# EAGLE design adapter - 1640 (EAGLE 7.5.0)

## Sheet 1 of 3
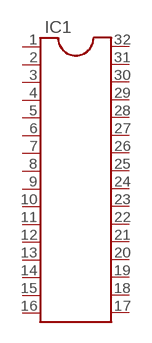
[diagram p0: schematic, sheet 1]

### Parts
IC1  DIL32  [DIL32]
Unconnected: IC1.1 IC1.2 IC1.3 IC1.4 IC1.5 IC1.6 IC1.7 IC1.8 IC1.9 IC1.10 IC1.11 IC1.12 IC1.13 IC1.14 IC1.15 IC1.16 IC1.17 IC1.18 IC1.19 IC1.20 IC1.21 IC1.22 IC1.23 IC1.24 IC1.25 IC1.26 IC1.27 IC1.28 IC1.29 IC1.30 IC1.31 IC1.32

## Sheet 2 of 3
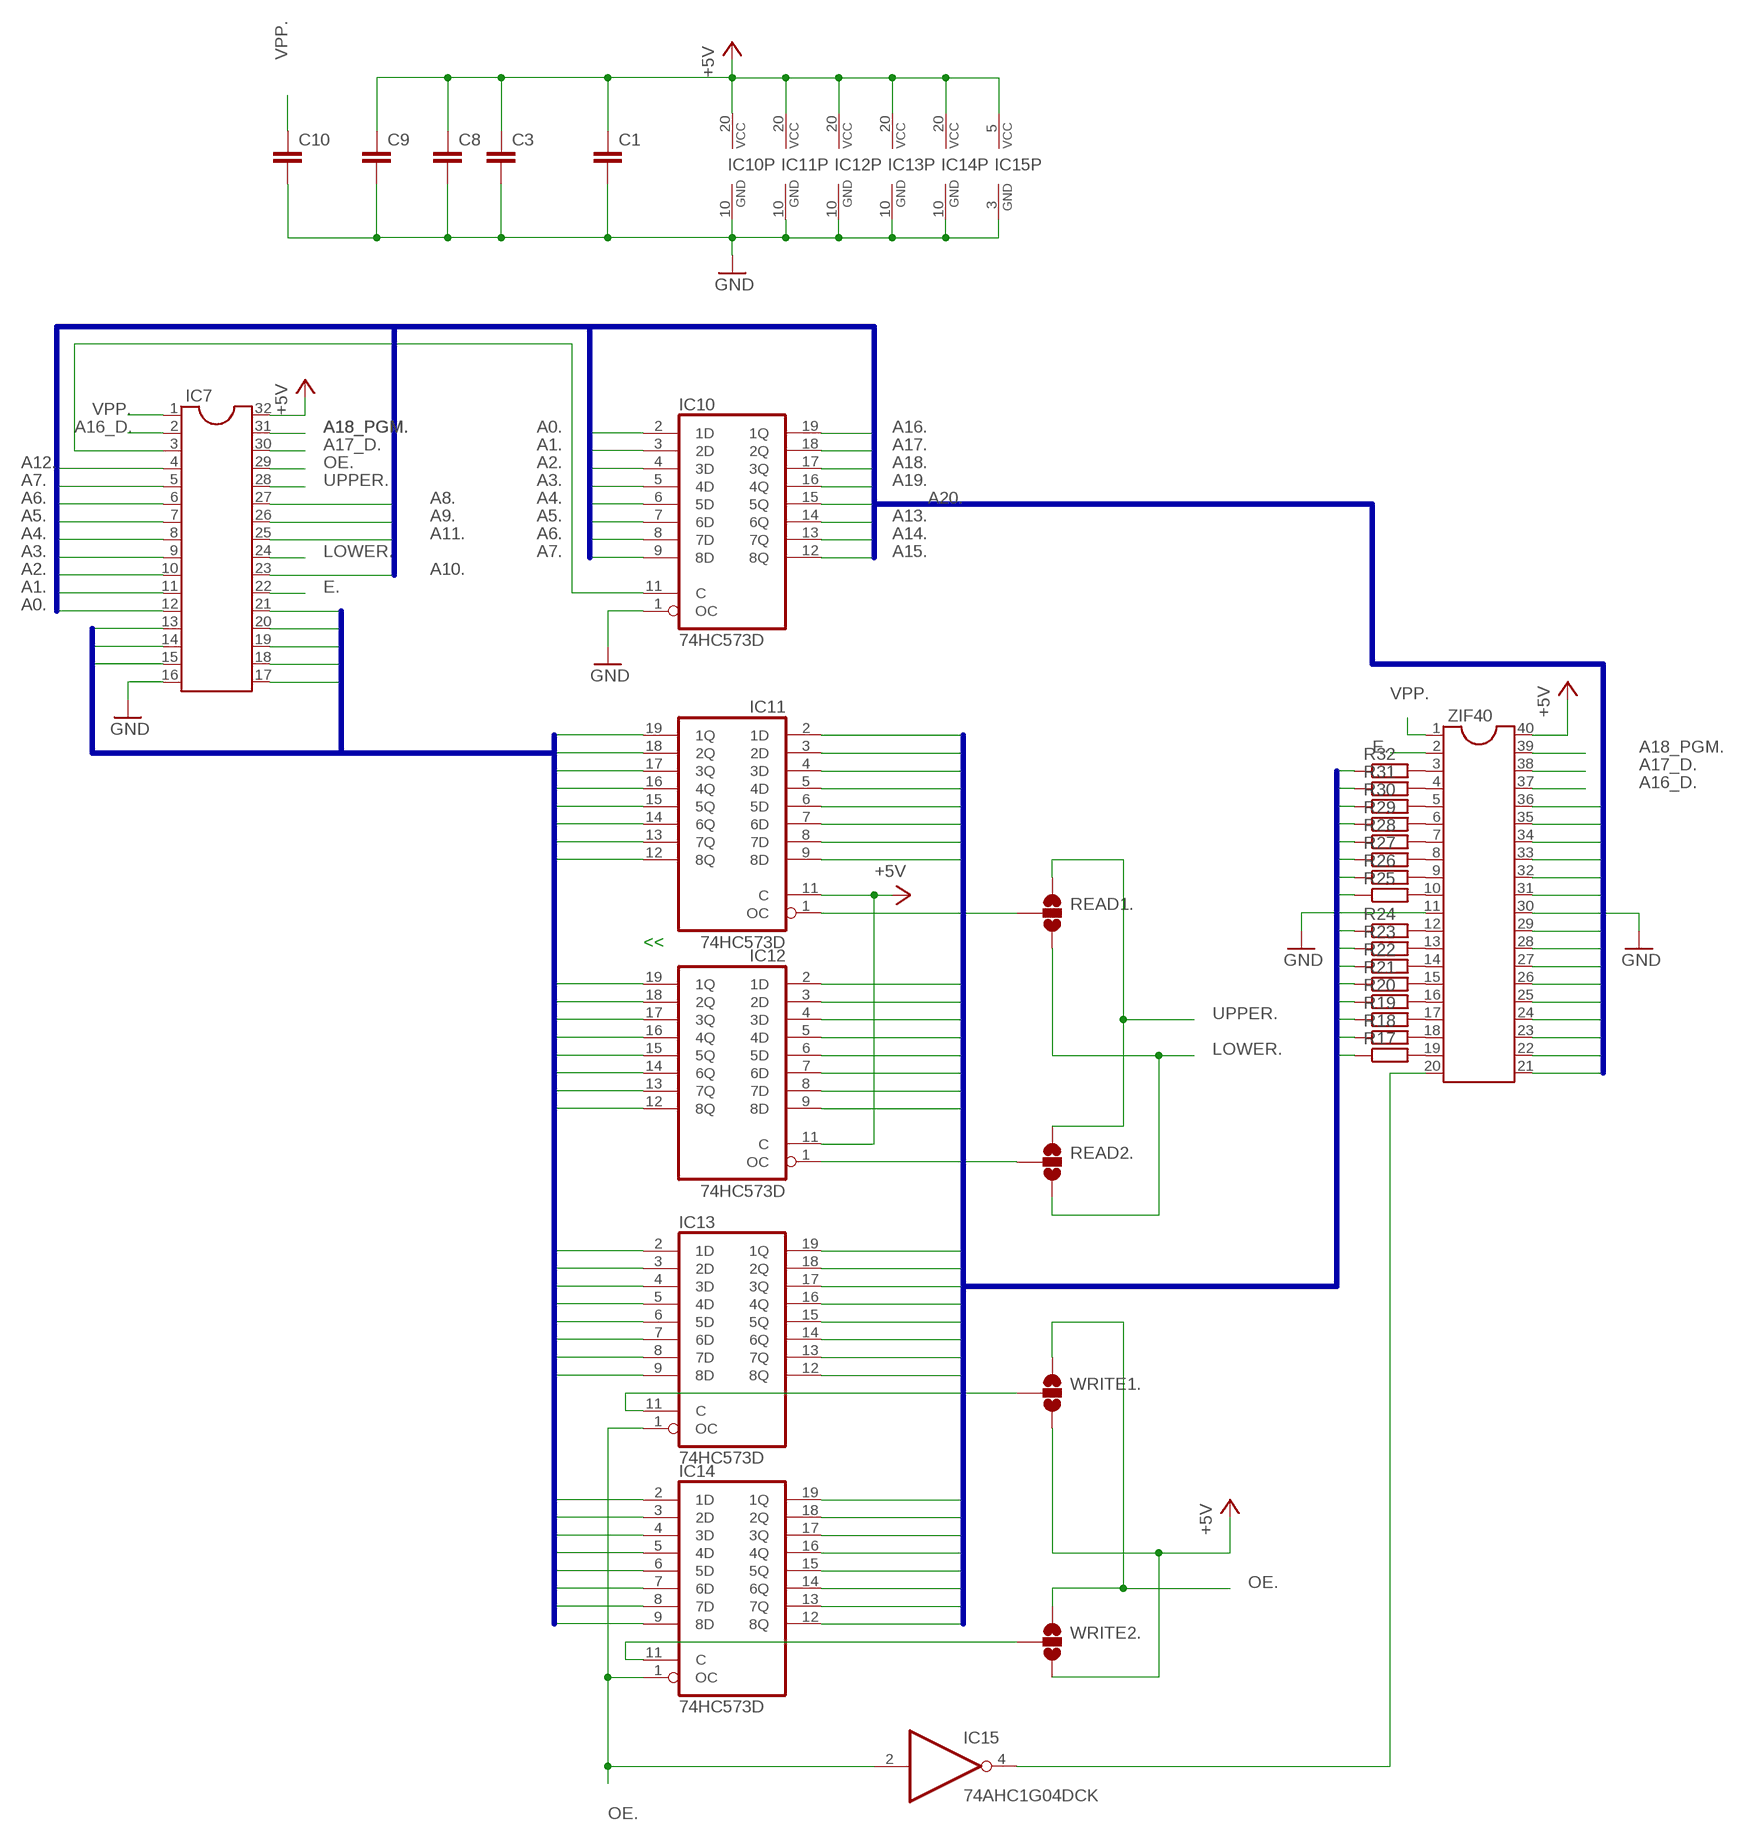
[diagram p1: schematic, sheet 2]

### Parts
C1  C-EUC1206  [C1206]
C3  C-EUC1206  [C1206]
C8  C-EUC1206  [C1206]
C9  C-EUC1206  [C1206]
C10  C-EUC1206  [C1206]
IC7  DIL32  [DIL32]
IC10  74HC573D  [SO20W]
IC11  74HC573D  [SO20W]
IC12  74HC573D  [SO20W]
IC13  74HC573D  [SO20W]
IC14  74HC573D  [SO20W]
IC15  74AHC1G04DCK  [SC70-5]
R17  R-EU_R0805  [R0805]
R18  R-EU_R0805  [R0805]
R19  R-EU_R0805  [R0805]
R20  R-EU_R0805  [R0805]
R21  R-EU_R0805  [R0805]
R22  R-EU_R0805  [R0805]
R23  R-EU_R0805  [R0805]
R24  R-EU_R0805  [R0805]
R25  R-EU_R0805  [R0805]
R26  R-EU_R0805  [R0805]
R27  R-EU_R0805  [R0805]
R28  R-EU_R0805  [R0805]
R29  R-EU_R0805  [R0805]
R30  R-EU_R0805  [R0805]
R31  R-EU_R0805  [R0805]
R32  R-EU_R0805  [R0805]
READ1.  JUMPER-PAD-3-NOYES_SILK  [PAD-JUMPER-3-NO_YES_SILK]
READ2.  JUMPER-PAD-3-NOYES_SILK  [PAD-JUMPER-3-NO_YES_SILK]
WRITE1.  JUMPER-PAD-3-NOYES_SILK  [PAD-JUMPER-3-NO_YES_SILK]
WRITE2.  JUMPER-PAD-3-NOYES_SILK  [PAD-JUMPER-3-NO_YES_SILK]
ZIF40  DIL40  [DIL40]

### Nets
+5V. [power]: C1.1 C3.1 C8.1 C9.1 IC7.32 IC10.20(VCC) IC11.11(C) IC11.20(VCC) IC12.11(C) IC12.20(VCC) IC13.20(VCC) IC14.20(VCC) IC15.5(VCC) WRITE1..3 WRITE2..3 ZIF40.40 ; supply symbol labelled +5V
A0.: IC7.12 IC10.2(1D)
A1.: IC7.11 IC10.3(2D) ZIF40.21
A2.: IC7.10 IC10.4(3D) ZIF40.22
A3.: IC7.9 IC10.5(4D) ZIF40.23
A4.: IC7.8 IC10.6(5D) ZIF40.24
A5.: IC7.7 IC10.7(6D) ZIF40.25
A6.: IC7.6 IC10.8(7D) ZIF40.26
A7.: IC7.5 IC10.9(8D) ZIF40.27
A8.: IC7.27 ZIF40.28
A9.: IC7.26 ZIF40.29
A10.: IC7.23 ZIF40.31
A11.: IC7.25 ZIF40.32
A12.: IC7.4 ZIF40.33
A13.: IC10.14(6Q) ZIF40.34
A14.: IC10.13(7Q) ZIF40.35
A15.: IC10.12(8Q) ZIF40.36
A16.: IC10.19(1Q)
A16_D.: IC7.2 ZIF40.37
A17.: IC10.18(2Q)
A17_D.: IC7.30 ZIF40.38
A18.: IC10.17(3Q)
A18_PGM.: IC7.31 ZIF40.39
A19.: IC10.16(4Q)
A20.: IC10.15(5Q)
D0.: IC7.13 IC11.19(1Q) IC12.19(1Q) IC13.2(1D) IC14.2(1D)
D1.: IC7.14 IC11.18(2Q) IC12.18(2Q) IC13.3(2D) IC14.3(2D)
D2.: IC7.15 IC11.17(3Q) IC12.17(3Q) IC13.4(3D) IC14.4(3D)
D3.: IC7.17 IC11.16(4Q) IC12.16(4Q) IC13.5(4D) IC14.5(4D)
D4.: IC7.18 IC11.15(5Q) IC12.15(5Q) IC13.6(5D) IC14.6(5D)
D5.: IC7.19 IC11.14(6Q) IC12.14(6Q) IC13.7(6D) IC14.7(6D)
D6.: IC7.20 IC11.13(7Q) IC12.13(7Q) IC13.8(7D) IC14.8(7D)
D7.: IC7.21 IC11.12(8Q) IC12.12(8Q) IC13.9(8D) IC14.9(8D)
E.: IC7.22 ZIF40.2
GND. [power]: C1.2 C3.2 C8.2 C9.2 C10.2 IC7.16 IC10.1(OC) IC10.10(GND) IC11.10(GND) IC12.10(GND) IC13.10(GND) IC14.10(GND) IC15.3(GND) ZIF40.11 ZIF40.30 ; supply symbol labelled GND
LOWER.: IC7.24 READ1..3 READ2..3
N$7: IC7.3 IC10.11(C)
N$8: IC11.1(OC) READ1..2
N$9: IC12.1(OC) READ2..2
N$10: IC13.11(C) WRITE1..2
N$11: IC14.11(C) WRITE2..2
N$12: IC15.4(O) ZIF40.20
N$29: R31.2 ZIF40.4
N$30: R32.2 ZIF40.3
N$31: R30.2 ZIF40.5
N$32: R29.2 ZIF40.6
N$33: R28.2 ZIF40.7
N$34: R27.2 ZIF40.8
N$35: R26.2 ZIF40.9
N$36: R25.2 ZIF40.10
N$37: R24.2 ZIF40.12
N$38: R23.2 ZIF40.13
N$39: R22.2 ZIF40.14
N$40: R21.2 ZIF40.15
N$41: R20.2 ZIF40.16
N$42: R19.2 ZIF40.17
N$43: R18.2 ZIF40.18
N$44: R17.2 ZIF40.19
OE.: IC7.29 IC13.1(OC) IC14.1(OC) IC15.2(I) WRITE1..1 WRITE2..1
Q0.: IC11.2(1D) IC13.19(1Q) R17.1
Q1.: IC11.3(2D) IC13.18(2Q) R18.1
Q2.: IC11.4(3D) IC13.17(3Q) R19.1
Q3.: IC11.5(4D) IC13.16(4Q) R20.1
Q4.: IC11.6(5D) IC13.15(5Q) R21.1
Q5.: IC11.7(6D) IC13.14(6Q) R22.1
Q6.: IC11.8(7D) IC13.13(7Q) R23.1
Q7.: IC11.9(8D) IC13.12(8Q) R24.1
Q8.: IC12.2(1D) IC14.19(1Q) R25.1
Q9.: IC12.3(2D) IC14.18(2Q) R26.1
Q10.: IC12.4(3D) IC14.17(3Q) R27.1
Q11.: IC12.5(4D) IC14.16(4Q) R28.1
Q12.: IC12.6(5D) IC14.15(5Q) R29.1
Q13.: IC12.7(6D) IC14.14(6Q) R30.1
Q14.: IC12.8(7D) IC14.13(7Q) R31.1
Q15.: IC12.9(8D) IC14.12(8Q) R32.1
UPPER.: IC7.28 READ1..1 READ2..1
VPP. [power]: C10.1 IC7.1 ZIF40.1

### Buses
A0.,A1.,A2.,A3.,A4.,A5.,A6.,A7.,A8.,A9.,A10.,A11.,A12.,A13.,A14.,A15.,A16.,A17.,A18.,A19.,A20.
D0,D1,D2,D3,D4,D5,D6,D7
Q0.,Q1.,Q2.,Q3.,Q4.,Q5.,Q6.,Q7.,Q8.,Q9.,Q10.,Q11.,Q12.,Q13.,Q14.,Q15.

### Notes on the sheet
- <<

## Sheet 3 of 3
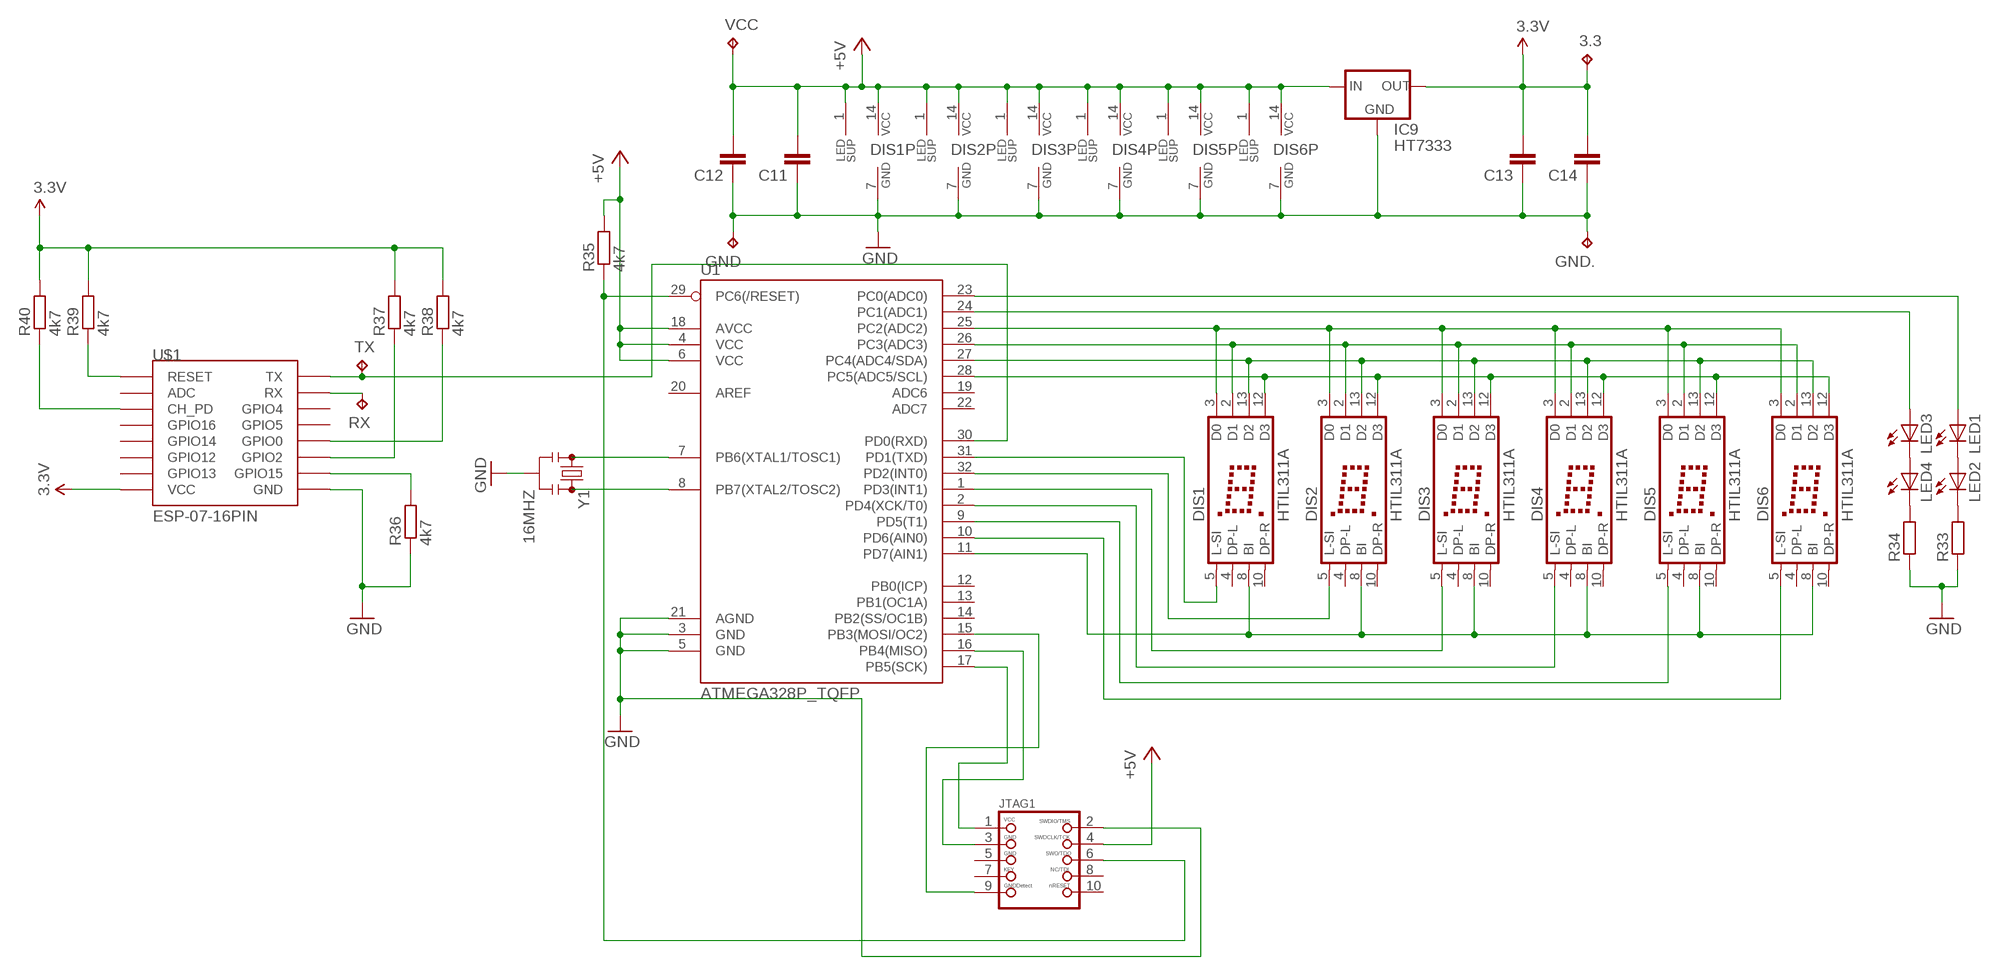
[diagram p2: schematic, sheet 3]

### Parts
3.3  TPTP15SQ  [TP15SQ]
C11  C-EUC1206  [C1206]
C12  C-EUC1206  [C1206]
C13  C-EUC1206  [C1206]
C14  C-EUC1206  [C1206]
DIS1  HTIL311A  [HTIL311A]
DIS2  HTIL311A  [HTIL311A]
DIS3  HTIL311A  [HTIL311A]
DIS4  HTIL311A  [HTIL311A]
DIS5  HTIL311A  [HTIL311A]
DIS6  HTIL311A  [HTIL311A]
GND  TPTP15SQ  [TP15SQ]
GND.  TPTP15SQ  [TP15SQ]
IC9  HT7333  [SOT-89]
JTAG1  JTAG-CORTEXM3  [2X05_1.27MM_SMT]
LED1  LED-0603  [LED-603]
LED2  LED-0603  [LED-603]
LED3  LED-0603  [LED-603]
LED4  LED-0603  [LED-603]
R33  R-EU_M1206  [M1206]
R34  R-EU_M1206  [M1206]
R35  4k7  R-EU_M1206  [M1206]
R36  4k7  R-EU_M1206  [M1206]
R37  4k7  R-EU_M1206  [M1206]
R38  4k7  R-EU_M1206  [M1206]
R39  4k7  R-EU_M1206  [M1206]
R40  4k7  R-EU_M1206  [M1206]
RX  TPTP15SQ  [TP15SQ]
TX  TPTP15SQ  [TP15SQ]
U1  ATMEGA328P_TQFP  [TQFP32-08]
U$1  ESP-07-16PIN  [ESP-07-16PIN]
VCC  TPTP15SQ  [TP15SQ]
Y1  16MHZ  RESONATOR16MHZ  [RESONATOR-SMD]

### Nets
3.3V: 3.3.TP C13.2 C14.2 IC9.1(OUT) R37.2 R38.2 R39.2 R40.2 U$1.VCC
+5V.2 [power]: C11.2 C12.2 DIS1.1(LEDSUP) DIS1.14(VCC) DIS2.1(LEDSUP) DIS2.14(VCC) DIS3.1(LEDSUP) DIS3.14(VCC) DIS4.1(LEDSUP) DIS4.14(VCC) DIS5.1(LEDSUP) DIS5.14(VCC) DIS6.1(LEDSUP) DIS6.14(VCC) IC9.3(IN) IC9.4(IN) JTAG1.4 R35.2 U1.4(VCC) U1.6(VCC) U1.18(AVCC) VCC.TP ; supply symbol labelled +5V
GND.2 [power]: C11.1 C12.1 C13.1 C14.1 DIS1.7(GND) DIS2.7(GND) DIS3.7(GND) DIS4.7(GND) DIS5.7(GND) DIS6.7(GND) GND..TP GND.TP IC9.2(GND) JTAG1.2 R33.1 R34.1 R36.1 U1.3(GND) U1.5(GND) U1.21(AGND) U$1.GND Y1.2 ; supply symbol labelled GND
N$45: DIS1.3(D0) DIS2.3(D0) DIS3.3(D0) DIS4.3(D0) DIS5.3(D0) DIS6.3(D0) U1.25(PC2(ADC2))
N$46: DIS1.2(D1) DIS2.2(D1) DIS3.2(D1) DIS4.2(D1) DIS5.2(D1) DIS6.2(D1) U1.26(PC3(ADC3))
N$47: DIS1.13(D2) DIS2.13(D2) DIS3.13(D2) DIS4.13(D2) DIS5.13(D2) DIS6.13(D2) U1.27(PC4(ADC4/SDA))
N$48: DIS1.12(D3) DIS2.12(D3) DIS3.12(D3) DIS4.12(D3) DIS5.12(D3) DIS6.12(D3) U1.28(PC5(ADC5/SCL))
N$49: DIS1.8(BI) DIS2.8(BI) DIS3.8(BI) DIS4.8(BI) DIS5.8(BI) DIS6.8(BI) U1.11(PD7(AIN1))
N$50: LED1.C LED2.A
N$51: LED3.C LED4.A
N$52: LED4.C R34.2
N$53: LED2.C R33.2
N$54: LED3.A U1.24(PC1(ADC1))
N$55: LED1.A U1.23(PC0(ADC0))
N$56: DIS1.5(L-SI) U1.31(PD1(TXD))
N$57: DIS2.5(L-SI) U1.32(PD2(INT0))
N$58: DIS3.5(L-SI) U1.1(PD3(INT1))
N$59: DIS4.5(L-SI) U1.2(PD4(XCK/T0))
N$60: DIS5.5(L-SI) U1.9(PD5(T1))
N$61: DIS6.5(L-SI) U1.10(PD6(AIN0))
N$62: JTAG1.1 U1.17(PB5(SCK))
N$63: JTAG1.6 R35.1 U1.29(PC6(/RESET))
N$64: JTAG1.3 U1.16(PB4(MISO))
N$65: JTAG1.9 U1.15(PB3(MOSI/OC2))
N$66: U1.7(PB6(XTAL1/TOSC1)) Y1.1
N$67: U1.8(PB7(XTAL2/TOSC2)) Y1.3
N$68: R39.1 U$1.REST(RESET)
N$69: R40.1 U$1.CH_PD
N$70: RX.TP U$1.RX
N$71: TX.TP U1.30(PD0(RXD)) U$1.TX
N$72: R36.2 U$1.GPIO15
N$73: R37.1 U$1.GPIO2
N$74: R38.1 U$1.GPIO0
Unconnected: DIS1.4(DP-L) DIS1.10(DP-R) DIS2.4(DP-L) DIS2.10(DP-R) DIS3.4(DP-L) DIS3.10(DP-R) DIS4.4(DP-L) DIS4.10(DP-R) DIS5.4(DP-L) DIS5.10(DP-R) DIS6.4(DP-L) DIS6.10(DP-R) JTAG1.5 JTAG1.7 JTAG1.8 JTAG1.10 U1.12(PB0(ICP)) U1.13(PB1(OC1A)) U1.14(PB2(SS/OC1B)) U1.19(ADC6) U1.20(AREF) U1.22(ADC7) U$1.ADC U$1.GPIO4 U$1.GPIO5 U$1.GPIO12 U$1.GPIO13 U$1.GPIO14 U$1.GPIO16

## Library data of the parts
3.3 GND GND. RX TX VCC = testpad:TP: Test pad
C1 C3 C8-C14 = rcl:C-EU: CAPACITOR, European symbol
DIS1-DIS6 = display-hp:HTIL311A: LED DISPLAY 1-character dot matrix, 2 decimal points Internal TTL MSI IC with Latch, Decoder, and Driver Source: http://www.taosinc.com .. til311-e6.pdf; OC_FARNELL: unknown; OC_NEWARK: unknown
IC1 IC7 = ic-package:DIL32: Dual In Line
IC9 = holtek2:HT73*
IC10-IC14 = 74xx-eu:74*573: 8-bit D latch BUS DRIVER
IC15 = 74xx-little-us:74*1G04: INVERTER Gate
JTAG1 = microbuilder:JTAG-CORTEXM3: Serial Wire (SW-DP) Connector This standard 0.05" 10-pin connector is for use with the Cortex M0/M3's native SWD (serial wire debugger) interface (SW-DP). Some boards support a 20-pin combined JTAG+SWD connector (SWJ-DP), such as the LPC1700 family, but many smaller devices only work with SWD which typically use the smaller 10-pin SW-DP connecter (the LPC1300 family, for example, only supports SWD). 2x05 1.27mm/0.05" Connector: This is the standard SMT connector defined by ARM for all Cortex devices, and should be used in most situations and for forward-compatibility since any new devices coming to market will likely use this connector. MOLEX 10 Pin 0.1" Connector: This 0.1" 10 pin connector has the same pin layout as the standard 0.05" connector, but is easier to work with if you are using standard jumper wires or custom cables to connect your SWD hardware. MOLEX 20 Pin 0.1" Connector: This 0.1" 20 pin connector is the same model used for ARM7/ARM9 JTAG debuggers, but is connected to match the pins on the Segger J-Link for ARM (which supports both JTAG and SWD debugging). See the following document from ARM for more information on Cortex M3 Debug Connectors: http://infocenter.arm.com/help/topic/com.arm.doc.faqs/attached/13634/cortex_debug_connectors.pdf And the following page for an overview with images of the different connector types: http://www.keil.com/peripherals/coresight/connectors.asp
LED1-LED4 = dp_devices:LED: Light Emitting Diode
R17-R40 = rcl:R-EU_: RESISTOR, European symbol
READ1. READ2. WRITE1. WRITE2. = SparkFun-Passives:JUMPER-PAD-3-NO
U1 = SparkFun-DigitalIC:ATMEGA328P_TQFP; PROD_ID: IC-09069
U$1 = esp8266modules:ESP-07-16PIN: ESP8266 Wifi Module ESP-07 - 16 pins; DIMENSIONS: 22.0 x 16.0 mm; PINS: 16; PITCH: 0.078" / 2 mm
Y1 = SparkFun-FreqCtrl:RESONATOR: Resonator Small SMD resonator. Used, eg, on the Arduino Pro/ Pro Mini boards. 8MHz- XTAL-08895 16MHz- XTAL-08900; PROD_ID: XTAL-08900
ZIF40 = ic-package:DIL40: Dual In Line

## Net classes
0 default: width 0.254 mm
1 power: width 0.508 mm

## Board
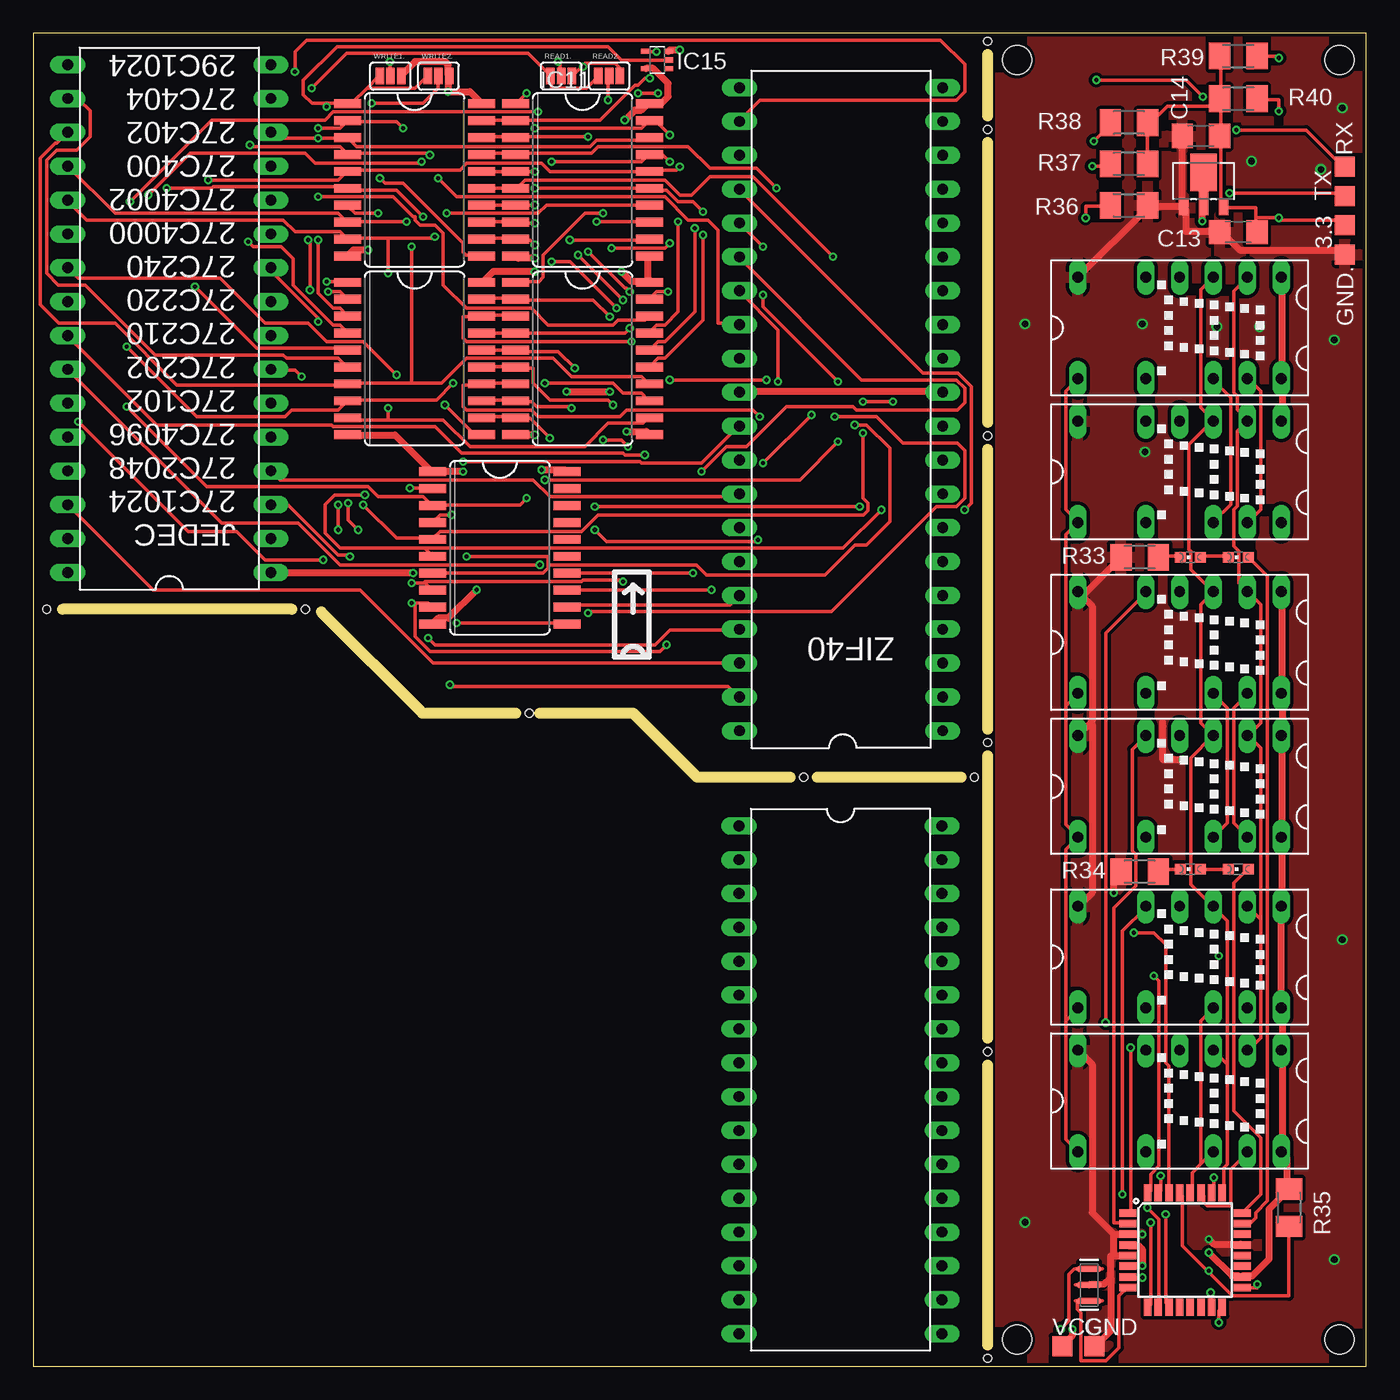
[diagram p3: board, top side]
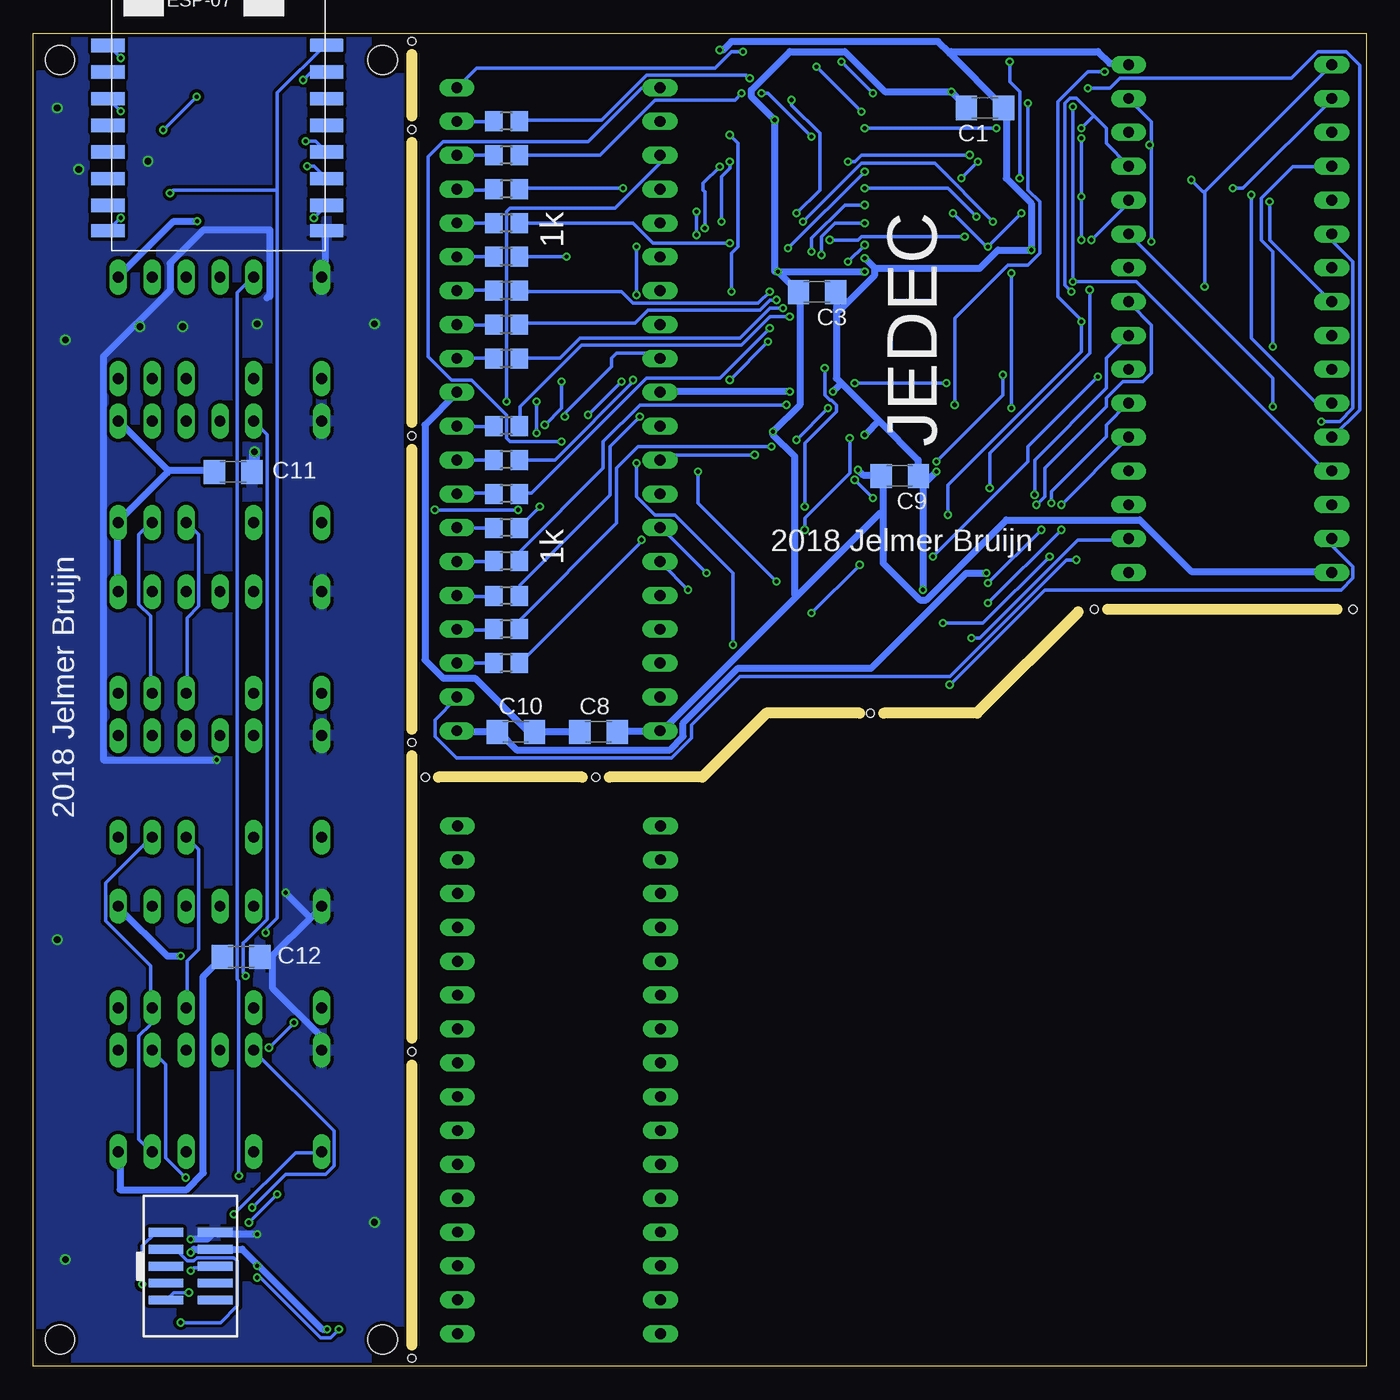
[diagram p4: board, bottom side, seen from below]

Size 100 x 100 mm. Coordinates in mm from the lower left corner, seen from the top.
Outline: 0,0 100,0 100,100 0,100 0,0
Copper layers (1*16): Top 0.035mm / dielectric 1.5mm / Bottom 0.035mm
Design rules "dirt_cheap_dirty_boards.v1": minimum track width 5mil, minimum drill 12mil, track to track 5mil, track to pad 5mil, pad to pad 5mil, via to via 5mil, smd to smd 0mil, copper to edge 10mil, drill to drill 10mil, minimum pad ring 10mil, minimum via ring 6mil, stop-mask expansion 2mil, vias tented up to drill 25mil, thermal gap 10mil
Holes 0.6 mm at 1,56.8 20.4,56.8 37.2,49 57.8,44.2 70.6,44.2 71.6,46.8 71.6,23.6 71.6,0.6 71.6,69.8 71.6,92.8 71.6,99.4
Holes 2.2 mm at 98,98 98,2 73.8,2 73.8,98
Milling: 12 lines

### Footprints (pad centres in the part's own frame; a part is rotated, then mirrored left to right if it is on the bottom)
TP15SQ = smd 1.5 x 1.5: TP 0,0
C1206 = smd 1.6 x 1.8: 1 -1.4,0; 2 1.4,0
HTIL311A = drill 0.813 long: 1 -3.81,7.62; 2 -3.81,5.08; 3 -3.81,2.54; 4 -3.81,0; 5 -3.81,-2.54; 7 -3.81,-7.62; 8 3.81,-7.62; 10 3.81,-2.54; 12 3.81,2.54; 13 3.81,5.08; 14 3.81,7.62
DIL32 = drill 0.813 long: 1 -19.05,-7.62; 2 -16.51,-7.62; 3 -13.97,-7.62; 4 -11.43,-7.62; 5 -8.89,-7.62; 6 -6.35,-7.62; 7 -3.81,-7.62; 8 -1.27,-7.62; 9 1.27,-7.62; 10 3.81,-7.62; 11 6.35,-7.62; 12 8.89,-7.62; 13 11.43,-7.62; 14 13.97,-7.62; 15 16.51,-7.62; 16 19.05,-7.62; 17 19.05,7.62; 18 16.51,7.62; 19 13.97,7.62; 20 11.43,7.62; 21 8.89,7.62; 22 6.35,7.62; 23 3.81,7.62; 24 1.27,7.62; 25 -1.27,7.62; 26 -3.81,7.62; 27 -6.35,7.62; 28 -8.89,7.62; 29 -11.43,7.62; 30 -13.97,7.62; 31 -16.51,7.62; 32 -19.05,7.62
SOT-89 = smd 0.7 x 1.1: 1 1.5,-2.385; 2 -1.5,-2.385 | smd 0.7 x 1.8: 3 0,-2.035 | smd 2 x 2.8: 4 0,0.265
SO20W = smd 0.66 x 2.032: 1 -5.715,-5.029; 2 -4.445,-5.029; 3 -3.175,-5.029; 4 -1.905,-5.029; 5 -0.635,-5.029; 6 0.635,-5.029; 7 1.905,-5.029; 8 3.175,-5.029; 9 4.445,-5.029; 10 5.715,-5.029; 11 5.715,5.029; 12 4.445,5.029; 13 3.175,5.029; 14 1.905,5.029; 15 0.635,5.029; 16 -0.635,5.029; 17 -1.905,5.029; 18 -3.175,5.029; 19 -4.445,5.029; 20 -5.715,5.029
SC70-5 = smd 0.4 x 0.7: 1 -0.65,-0.85; 2 0,-0.85; 3 0.65,-0.85; 4 0.65,0.85; 5 -0.65,0.85
2X05_1.27MM_SMT = smd 0.65 x 2.6: 1 -2.54,-1.85; 2 -2.54,1.85; 3 -1.27,-1.85; 4 -1.27,1.85; 5 0,-1.85; 6 0,1.85; 7 1.27,-1.85; 8 1.27,1.85; 9 2.54,-1.85; 10 2.54,1.85
LED-603 = smd 0.8 x 0.8: A 0,-0.75; C 0,0.75
R0805 = smd 1.3 x 1.5: 1 -0.95,0; 2 0.95,0
M1206 = smd 1.6 x 2: 1 -1.4,0; 2 1.4,0
PAD-JUMPER-3-NO_YES_SILK = smd 0.635 x 1.27: 1 -0.813,0; 2 0,0; 3 0.813,0
TQFP32-08 = smd 1.27 x 0.559: 1 -4.293,2.8; 2 -4.293,2; 3 -4.293,1.2; 4 -4.293,0.4; 5 -4.293,-0.4; 6 -4.293,-1.2; 7 -4.293,-2; 8 -4.293,-2.8; 17 4.293,-2.8; 18 4.293,-2; 19 4.293,-1.2; 20 4.293,-0.4; 21 4.293,0.4; 22 4.293,1.2; 23 4.293,2; 24 4.293,2.8 | smd 0.559 x 1.27: 9 -2.8,-4.293; 10 -2,-4.293; 11 -1.2,-4.293; 12 -0.4,-4.293; 13 0.4,-4.293; 14 1.2,-4.293; 15 2,-4.293; 16 2.8,-4.293; 25 2.8,4.293; 26 2,4.293; 27 1.2,4.293; 28 0.4,4.293; 29 -0.4,4.293; 30 -1.2,4.293; 31 -2,4.293; 32 -2.8,4.293
ESP-07-16PIN = smd 2.5 x 1: ADC -8.2,3.8; CH_PD -8.2,1.8; GND 8.2,-8.105; GPIO0 8.2,-2.2; GPIO2 8.2,-4.2; GPIO4 8.2,1.8; GPIO5 8.2,-0.2; GPIO12 -8.2,-4.2; GPIO13 -8.2,-6.2; GPIO14 -8.2,-2.2; GPIO15 8.2,-6.2; GPIO16 -8.2,-0.2; REST -8.2,5.8; RX 8.2,3.8; TX 8.2,5.8; VCC -8.2,-8.105
RESONATOR-SMD = smd 0.45 x 1.905: 1 -1.2,0; 2 0,0; 3 1.2,0
DIL40 = drill 0.813 long: 1 -24.13,-7.62; 2 -21.59,-7.62; 3 -19.05,-7.62; 4 -16.51,-7.62; 5 -13.97,-7.62; 6 -11.43,-7.62; 7 -8.89,-7.62; 8 -6.35,-7.62; 9 -3.81,-7.62; 10 -1.27,-7.62; 11 1.27,-7.62; 12 3.81,-7.62; 13 6.35,-7.62; 14 8.89,-7.62; 15 11.43,-7.62; 16 13.97,-7.62; 17 16.51,-7.62; 18 19.05,-7.62; 19 21.59,-7.62; 20 24.13,-7.62; 21 24.13,7.62; 22 21.59,7.62; 23 19.05,7.62; 24 16.51,7.62; 25 13.97,7.62; 26 11.43,7.62; 27 8.89,7.62; 28 6.35,7.62; 29 3.81,7.62; 30 1.27,7.62; 31 -1.27,7.62; 32 -3.81,7.62; 33 -6.35,7.62; 34 -8.89,7.62; 35 -11.43,7.62; 36 -13.97,7.62; 37 -16.51,7.62; 38 -19.05,7.62; 39 -21.59,7.62; 40 -24.13,7.62

### Placement (x,y rotation side)
3.3  98.4,85.6 0 top
C1  28.6,94.4 0 bottom
C3  41.2,80.6 0 bottom
C8  57.6,47.6 180 bottom
C9  35,66.8 0 bottom
C10  63.8,47.6 0 bottom
C11  85,67.1 180 bottom
C12  84.4,30.7 180 bottom
C13  90.4,85.1 0 top
C14  87.6,92.3 0 top
DIS1  86,77.9 270 top
DIS2  86,67.1 270 top
DIS3  86,54.3 270 top
DIS4  86,43.5 270 top
DIS5  86,30.7 270 top
DIS6  86,19.9 270 top
GND  79.6,1.5 0 top
GND.  98.4,83.4 0 top
IC1  60.56,21.49 270 top
IC7  10.2,78.6 90 top
IC9  87.8,89.3 0 top
IC10  35,61.4 270 top
IC11  41.2,89 270 top
IC12  41.2,75.6 270 top
IC13  28.6,89 270 top
IC14  28.6,75.6 270 top
IC15  46.8,98 90 top
JTAG1  88.2,7.5 270 bottom
LED1  90.4,60.7 90 top
LED2  86.8,60.7 90 top
LED3  90.4,37.3 90 top
LED4  86.8,37.3 90 top
R17  64.5,93.4 180 bottom
R18  64.5,90.85 180 bottom
R19  64.5,88.3 180 bottom
R20  64.5,85.75 180 bottom
R21  64.5,83.25 180 bottom
R22  64.5,80.7 180 bottom
R23  64.5,78.15 180 bottom
R24  64.5,75.6 180 bottom
R25  64.5,70.55 180 bottom
R26  64.5,68 180 bottom
R27  64.5,65.45 180 bottom
R28  64.5,62.9 180 bottom
R29  64.5,60.4 180 bottom
R30  64.5,57.8 180 bottom
R31  64.5,55.3 180 bottom
R32  64.5,52.75 180 bottom
R33  83,60.7 0 top
R34  83,37.1 0 top
R35  94.2,11.9 90 top
R36  82.2,87.1 180 top
R37  82.2,90.2 0 top
R38  82.2,93.3 0 top
R39  90.4,98.3 180 top
R40  90.4,95.1 180 top
READ1.  39.6,96.8 0 top
READ2.  43.2,96.8 0 top
RX  98.4,90 0 top
TX  98.4,87.8 0 top
U1  86.4,8.7 0 top
U$1  86.2,93.3 0 bottom
VCC  77.2,1.5 0 top
WRITE1.  26.8,96.8 0 top
WRITE2.  30.4,96.8 0 top
Y1  79.2,6.1 270 top
ZIF40  60.6,71.8 90 top

### Tracks (layer width: path | path; a pad name or v marks a point on that pad's centre or on a via)
3.3V  (via drill 0.3)
  Top 0.254: 91.7,86.15 91.7,85.15 C13.2 | 91.7,86.15 91.7,86.9 89.33,86.9 IC9.1 89.2,87.03 89.08,87.15 89.08,92.28 C14.2 89.08,92.4 89.08,95.03 R40.2 | 91.7,86.15 v93.45,86.15 93.5,86 98,86 3.3.TP | R37.2 83.58,90.15 83.58,93.03 R38.2 83.7,93.15 85.08,94.53 88.95,94.53 R40.2 | R39.2 89.08,98.28 89.08,95.15 R40.2
  Bottom 0.254: v93.45,86.15 94.33,85.28 U$1.VCC
+5V.  (via drill 0.3)
  Top 0.508: WRITE1..3 27.62,96.88 28.62,97.88 30.88,97.88 31.12,97.62 31.12,96.88 WRITE2..3 31.12,96.62 v31.12,95.62 32.75,95.62 33.62,94.75 IC13.20 | v44.12,82.12 44.88,81.38 46.12,81.38 IC12.20 46.12,81.62 46.12,83.25 IC11.11 | v44.5,70.12 46,70.12 46.12,70 IC12.11 | v37.62,82.12 34.5,82.12 33.75,81.38 IC14.20 | v44.38,93.5 45.12,94.25 45.62,94.25 46,94.62 IC11.20 46.38,94.75 47.12,94.75 47.62,95.25 47.62,96.25 46.5,97.38 46,97.38 IC15.5 | v38.12,67.25 39.88,67.25 40,67.12 IC10.20
  Bottom 0.508: C1.1 30,94.5 v31.12,95.62 36.12,95.62 39.12,98.62 43.25,98.62 46.12,95.75 46.12,95.25 v44.38,93.5 44.38,82.12 v44.12,82.12 | v44.12,82.12 C3.1 42.5,80.38 42.5,72.12 v44.5,70.12 44.5,69.88 42.88,68.25 42.88,57.88 42.75,57.75 | v44.12,82.12 v37.62,82.12 | C8.1 56.12,47.62 53,47.62 ZIF40.40 52.75,47.75 42.75,57.75 | v38.12,67.25 37.75,66.88 36.5,66.88 C9.1 36.25,66.62 36.25,64 | 36.25,64 36.25,60.25 33.5,57.5 33,57.5 27,63.5 17,63.5 13.12,59.62 2.62,59.62 IC7.32 | 42.75,57.75 36.5,64 36.25,64
+5V.2  (via drill 0.3)
  Top 0.508: IC9.4 87.83,89.53 87.83,87.28 IC9.3 87.83,87.03 87.7,86.9 v87.7,85.9 | DIS2.1 93.7,71.03 93.7,74.03 DIS1.14 93.7,74.28 93.7,81.65 DIS1.1 | U1.6 82.2,7.53 v83.2,7.53 83.2,8.78 82.95,9.03 82.2,9.03 U1.4 | v77.95,2.77 77.95,2.27 77.2,1.52 VCC.TP | v88.2,8.53 89.95,6.78 90.45,6.78 U1.18 90.7,6.78 91.45,6.78 92.7,8.03 92.7,11.78 94.2,13.28 R35.2 94.08,13.53 94.08,15.65 93.7,16.02 DIS6.14 93.7,16.27 93.7,23.52 DIS6.1 93.7,23.77 93.7,26.77 DIS5.14 93.58,27.15 93.58,34.27 DIS5.1 93.7,34.52 93.7,39.65 DIS4.14 93.7,39.9 93.7,47.15 DIS4.1 93.7,47.4 93.7,50.4 DIS3.14 93.7,50.65 93.7,58.02 DIS3.1
  Bottom 0.508: DIS3.1 93.7,58.15 93.7,63.15 DIS2.14 93.58,63.4 89.95,67.03 89.95,67.25 | v87.7,85.9 89.45,85.9 93.58,81.78 DIS1.1 | 89.95,67.25 89.95,67.28 93.58,70.9 DIS2.1 | v77.95,2.77 78.33,2.77 83.14,7.59 | 83.14,7.59 84.33,8.78 86.33,8.78 JTAG1.4 86.58,8.78 87.95,8.78 v88.2,8.53 | v83.2,7.53 83.14,7.59 | v88.95,30.77 89.95,30.77 93.58,34.4 DIS5.1 | C12.2 87.25,29.25 87.25,14.5 88.5,13.25 93.5,13.25 93.5,16 DIS6.14 | 89.95,67.25 86.5,67.25 C11.2
A0.  (via drill 0.3)
  Top 0.254: v28.25,65.88 29.88,65.88 IC10.2 | v20.75,80.75 20.75,84.5 v20.62,84.5
  Bottom 0.254: v28.25,65.88 28.25,68.5 20.75,76 v20.75,80.75 | v20.62,84.5 17.75,87.38 IC7.12
A1.  (via drill 0.3)
  Top 0.254: v7,72 13,66 25.12,66 25.88,65.25 29.25,65.25 29.88,64.62 IC10.3 30,64.62 36.5,64.62 v37,65.12 | v60.38,69.38 57.5,66.5 v38.38,66.5
  Bottom 0.254: v7,72 7,74.12 17.75,84.88 IC7.11 | v60.38,69.38 64.25,69.38 64.5,69.62 64.5,71.38 67.12,74 68.62,74 70.38,75.75 70.38,90.75 69.25,91.88 58.38,91.88 54.38,95.88 53,95.88 ZIF40.21 | v37,65.12 v38.38,66.5
A2.  (via drill 0.3)
  Top 0.254: v31.38,63.88 30.5,63.88 30,63.38 IC10.4 | v21.38,78.38 21.38,78.62 17.88,82.12 17.88,82.38 IC7.10 | v19.62,97.12 19.62,98.62 20.5,99.5 68.05,99.5 69.88,97.67 69.88,95.62 69.25,95 54.5,95 53,93.5 ZIF40.22
  Bottom 0.254: v31.38,63.88 31.38,66.12 21.38,76.12 v21.38,78.38 21.38,78.5 23.12,80.25 23.12,94.88 20.88,97.12 v19.62,97.12
A3.  (via drill 0.3)
  Top 0.254: v24.75,64.62 27.25,62.12 29.88,62.12 IC10.5 30,62.12 30.5,62.62 41.12,62.62 42.38,63.88 62.29,63.88 62.62,64.21 62.62,64.75 62.25,65.12 v62.25,70 | v62.25,72.38 v64.5,72.38
  Bottom 0.254: v24.75,64.62 24.12,65.25 24.12,67.38 19.5,72 19.5,72.62 18.25,73.88 16.75,73.88 16.12,74.5 16.12,78.12 17.75,79.75 IC7.9 | v64.5,72.38 64.5,86.62 64.25,86.88 56.38,86.88 53,90.25 53,90.75 ZIF40.23 | v62.25,70 v62.25,72.38
A4.  (via drill 0.3)
  Top 0.254: 29.44,61.31 29.38,61.38 23,61.38 21.88,62.5 21.88,64.63 22.62,65.38 v24.88,65.38 | 29.44,61.31 29.88,60.88 IC10.6 | v69.88,64.25 70.38,64.75 70.38,73.5 69.38,74.5 66.75,74.5 53,88.25 ZIF40.24 | v63.62,64.25 60.75,61.38 29.5,61.38 29.44,61.31
  Bottom 0.254: v24.88,65.38 24.88,68 19.5,73.38 19.5,75.62 17.88,77.25 IC7.8 | v63.62,64.25 v69.88,64.25
A5.  (via drill 0.3)
  Top 0.254: 38.62,60.12 38.62,60.75 v32.5,60.75 | 38.62,60.12 38.62,59.88 38.25,59.5 30,59.5 IC10.7 | v20.12,74.25 19.62,74.75 17.88,74.75 IC7.7 | v54.75,84 ZIF40.25 | v54.75,80.38 54.75,79.5 v60.38,73.88 | v61.62,70.62 62.5,70.62 64.25,68.88 64.25,63.38 62.49,61.62 61.62,61.62 59.38,59.38 50.5,59.38 49.75,60.12 38.62,60.12
  Bottom 0.254: v32.5,60.75 25.38,67.88 25.38,69 v20.12,74.25 | v54.75,80.38 v54.75,84 | v60.38,73.88 60.38,71.88 v61.62,70.62
A6.  (via drill 0.3)
  Top 0.254: 29.38,58.75 29.88,58.25 IC10.8 | v28.38,58.75 29.38,58.75 | v24.38,62.75 23.62,63.5 v23.62,64.75 | v50.12,67.12 52,69 53.5,69 56.5,72 61.5,72 61.75,71.75 69.31,71.75 69.88,72.31 69.88,73.38 69.25,74 62.12,74 53,83.12 ZIF40.26 | v44.25,58.88 44.12,59 41.25,59 41.12,58.88 29.38,58.88 29.38,58.75
  Bottom 0.254: v24.38,62.75 v28.38,58.75 | v23.62,64.75 23.62,65.62 19.5,69.75 19.5,70.62 17.88,72.25 IC7.6 | v50.12,67.12 50.12,64.75 v44.25,58.88
A7.  (via drill 0.3)
  Top 0.254: v22.88,64.62 v22.88,62.75 | IC10.9 29.88,57 29.62,57.25 v28.38,57.25 28.62,57.12 28.62,54.75 29.75,53.62 47,53.62 v47.5,54.12 | v55.88,73.88 55.88,77.75 53,80.62 ZIF40.27 | v54.75,67.75 v58.38,71.38
  Bottom 0.254: v22.88,62.75 v28.38,57.25 | v22.88,64.62 17.88,69.62 IC7.5 | v58.38,71.38 v55.88,73.88 | v54.75,67.75 54.75,65.25 53.38,63.88 51.88,63.88 47.5,59.5 v47.5,54.12
A8.  (via drill 0.3)
  Top 0.254: v8.62,87.88 11.75,91 20.38,91 21.12,90.25 29,90.25 v29.12,90.38 | v30.38,89.12 31.75,87.75 47.38,87.75 49.12,86 50.62,86 51.38,85.25 51.38,78.25 52.88,78.25 ZIF40.28
  Bottom 0.254: IC7.27 3.75,72.25 8.62,77.12 v8.62,87.88 | v30.38,89.12 v29.12,90.38
A9.  (via drill 0.3)
  Top 0.254: v38,60.12 23,60.12 19.88,63.25 14.12,63.25 2.62,74.75 IC7.26 | v41.62,56.5 41.75,56.62 59.88,56.62 67.75,64.5 69.25,64.5 69.88,65.12 69.88,68.7 69.33,69.25 65.25,69.25 63.25,71.25 v60.12,71.25
  Bottom 0.254: v41.62,56.5 v38,60.12 | v60.12,71.25 60.12,71.5 56.62,75 56.62,75.62 56.25,76 53.38,76 53,75.62 ZIF40.29
A10.  (via drill 0.3)
  Top 0.254: v27.25,74.38 24.75,76.88 22,76.88 20.62,78.25 17.38,78.25 14,81.62 3.38,81.62 2.62,82.38 IC7.23 | v32.25,67.88 45.5,67.88 45.62,67.75 50.12,67.75 52.88,70.5 ZIF40.31
  Bottom 0.254: v27.25,74.38 27.25,72.88 v32.25,67.88
A11.  (via drill 0.3)
  Top 0.254: v45.88,68.38 44.38,68.38 44.25,68.5 32.12,68.5 30.12,70.5 22.5,70.5 22.38,70.62 9.25,70.62 2.62,77.25 IC7.25
  Bottom 0.254: v45.88,68.38 52.5,68.38 52.88,68 ZIF40.32
A12.
  Top 0.254: IC7.4 17.88,67.12 18.5,66.5 37.5,66.5 38.75,65.25 52.75,65.25 52.88,65.38 ZIF40.33
A13.  (via drill 0.3)
  Top 0.254: v49.5,59.5 40.12,59.5 IC10.14
  Bottom 0.254: v49.5,59.5 52.88,62.88 ZIF40.34
A14.  (via drill 0.3)
  Top 0.254: v50.88,58.25 40.12,58.25 IC10.13
  Bottom 0.254: v50.88,58.25 52.88,60.25 ZIF40.35
A15.
  Top 0.254: IC10.12 40.12,57 40.25,57.12 52.25,57.12 52.88,57.75 ZIF40.36
A16_D.  (via drill 0.3)
  Top 0.254: v29.62,54.62 30.12,54.12 46.62,54.12 47.75,55.25 52.88,55.25 ZIF40.37
  Bottom 0.254: v29.62,54.62 29,54.62 21.62,62 17.88,62 IC7.2
A17_D.
  Top 0.254: ZIF40.38 30,52.75 24.5,58.25 9,58.25 2.62,64.62 IC7.30
A18_PGM.  (via drill 0.3)
  Top 0.254: v31.25,51.12 31.38,51 52.12,51 52.88,50.25 ZIF40.39
  Bottom 0.254: v31.25,51.12 24.12,58.25 1.88,58.25 1,59.12 1,60 2.5,61.5 2.5,62 IC7.31
D0.  (via drill 0.3)
  Top 0.254: v47.62,80.62 46.75,80.62 46.25,80.12 IC12.19 | v47.75,92.38 46.75,93.38 46.25,93.38 IC11.19 46.12,93.38 45.62,92.88 v37.62,92.88 | v22.12,80.62 23,80.62 23.5,80.12 IC14.2 | v21.38,92.88 23,92.88 23.5,93.38 IC13.2 23.62,93.38 27.25,93.38 v27.75,92.88
  Bottom 0.254: v47.62,80.62 47.62,83.5 47.12,84 47.12,91.75 v47.75,92.38 | v22.12,80.62 22.62,81.12 22.62,94.75 22.25,95.12 21.75,95.12 20.44,93.81 | 20.44,93.81 19.5,92.88 19.5,91.75 17.88,90.12 IC7.13 | 20.44,93.81 v21.38,92.88 | v27.75,92.88 v37.62,92.88
D1.  (via drill 0.3)
  Top 0.254: v21.38,84.5 21.38,80.5 22.5,79.38 23,79.38 23.5,78.88 IC14.3 | v21.38,87.75 27,87.75 28.5,86.25 28.62,86.25 28.62,86 29,85.62 30.12,85.62 30.75,85 30.75,81.12 32.5,79.38 37.38,79.38 38.62,78.12 43.5,78.12 43.88,78.5 45.88,78.5 46.12,78.75 IC12.18 | IC11.18 46.12,92.12 46,92 42.25,92 41.75,91.5 24.25,91.5 23.62,92.12 IC13.3 23.5,92.12 v21.38,92.12 18.25,92.12 17.88,92.5 IC7.14
  Bottom 0.254: v21.38,92.12 v21.38,87.75 v21.38,84.5
D2.  (via drill 0.3)
  Top 0.254: v48.38,85.88 48.38,79.12 47.38,78.12 46.75,78.12 46.25,77.62 IC12.17 | v47.75,90.38 47.25,90.88 46.25,90.88 IC11.17 46.12,90.88 45.62,90.38 v38.88,90.38 | v16.12,84.38 16.5,84 18.59,84 19.5,83.09 19.5,81.12 22.5,78.12 23,78.12 23.5,77.62 IC14.4 | v16.25,91.62 16.38,91.5 23,91.5 23.5,91 IC13.4 23.62,91 29.62,91 v29.75,90.88
  Bottom 0.254: v48.38,85.88 48.38,89.25 47.75,89.88 v47.75,90.38 | 16.12,91.62 16.12,93.38 17.75,95 IC7.15 | 16.12,91.62 v16.12,84.38 | v16.25,91.62 16.12,91.62 | v38.88,90.38 38.38,90.38 37.88,90.88 v29.75,90.88
D3.  (via drill 0.3)
  Top 0.254: v49.62,85.38 49.62,79.12 47.38,76.88 46.88,76.88 46.25,76.25 IC12.16 | v48.5,90 48.25,89.75 46.25,89.75 IC11.16 46.12,89.62 38.75,89.62 38.12,90.25 32.5,90.25 32,89.75 23.62,89.75 IC13.5 23.5,89.62 22.88,89 v13.12,89 | v12.12,81 16.75,76.38 23.38,76.38 23.5,76.25 IC14.5
  Bottom 0.254: v49.62,85.38 49.62,88.12 49.75,88.25 49.75,88.75 v48.5,90 | 12.12,88.12 v12.12,81 | 12.12,88.12 2.62,97.62 IC7.17 | v13.12,89 12.25,88.12 12.12,88.12
D4.  (via drill 0.3)
  Top 0.254: v50.25,84.88 50.25,78.5 47.38,75.62 46.88,75.62 46.25,75 IC12.15 | v50.25,86.62 49.5,87.38 48.38,87.38 47.5,88.25 46.25,88.25 IC11.15 46.12,88.38 v37.62,88.38 | IC14.6 23.5,75 22.88,75.62 19,75.62 18.75,75.88 9.12,75.88 3.88,81.12 1.88,81.12 1,82 1,90.5 1.75,91.25 3.25,91.25 4.25,92.25 4.25,94.17 3.42,95 2.62,95 IC7.18 | v10,88.38 13.38,88.38 13.5,88.5 23.38,88.5 23.5,88.38 IC13.6 23.62,88.25 27.25,88.25 v29.25,86.25
  Bottom 0.254: v50.25,86.62 v50.25,84.88 | v10,88.38 9.25,88.38 2.62,95 IC7.18 | v37.62,88.38 31.38,88.38 v29.25,86.25
D5.  (via drill 0.3)
  Top 0.254: 28.38,73.75 30.62,73.75 32.5,75.62 39,75.62 40.38,74.25 45.62,74.25 46.12,73.75 IC12.14 | 28.38,73.75 23.62,73.75 IC14.7 23.5,73.62 10.75,73.62 6.12,78.25 1.89,78.25 0.5,79.64 0.5,90.62 1.62,91.75 1.75,91.75 2.5,92.5 IC7.19 | v25.88,86.5 24.12,86.5 23.62,87 IC13.7 | 28.38,73.75 v28.38,84 | v31,86.5 37.88,86.5 38.5,87.12 46.12,87.12 IC11.14
  Bottom 0.254: v25.88,86.5 v28.38,84 28.5,84 v31,86.5
D6.  (via drill 0.3)
  Top 0.254: v7,76.5 12.25,71.25 18.88,71.25 19.38,71.75 22.88,71.75 23.5,72.38 IC14.8 23.62,72.5 30.25,72.5 v31.5,73.75 | IC7.20 2.62,90 6.12,86.5 22.88,86.5 23.5,85.88 IC13.8 23.62,85.88 v28,85.88 | v38.38,73.75 43.5,73.75 44.25,73 45.62,73 46.12,72.5 IC12.13 | v42.25,85.88 46.12,85.88 IC11.13
  Bottom 0.254: v7,76.5 7,83.62 7.88,84.5 7.88,87.62 5.5,90 2.62,90 IC7.20 | v31.5,73.75 v38.38,73.75 | v42.25,85.88 37.88,90.25 32.38,90.25 v28,85.88
D7.  (via drill 0.3)
  Top 0.254: 26.62,71 30.75,71 32.75,69 41.38,69 43.12,70.75 45.75,70.75 46.12,71.12 IC12.12 | 26.62,71 23.75,71 23.62,71.12 IC14.9 | IC7.21 2.62,87.38 4,86 18.75,86 19.62,85.12 23,85.12 23.5,84.62 IC13.9 23.62,84.62 26.62,84.62 | v40.25,84.5 46.12,84.5 IC11.12 | v30.12,84.75 30,84.62 26.62,84.62 | v26.62,71.88 26.62,71 | 26.62,84.62 v26.62,82
  Bottom 0.254: v40.25,84.5 38.12,84.5 37.88,84.75 v30.12,84.75 | v26.62,82 v26.62,71.88
E.  (via drill 0.3)
  Top 0.254: v3.38,70.88 11.62,62.62 15.25,62.62 17.38,60.5 v21.75,60.5
  Bottom 0.254: v3.38,70.88 2,70.88 1,71.88 1,82.88 2.5,84.38 2.5,84.88 IC7.22 | v21.75,60.5 22.5,60.5 31.25,51.75 47,51.75 50.62,48.12 50.62,47.12 52.12,45.62 68.25,45.62 69.88,47.25 69.88,48.5 68.25,50.12 ZIF40.2
GND.  (via drill 0.3)
  Top 0.508: v25.12,83.75 24,83.75 23.62,83.38 IC13.10 | ZIF40.30 53,73.12 68.12,73.12 ZIF40.11 | IC14.10 23.62,69.88 27.12,69.88 29.88,67.12 IC10.1 30.12,67.12 v32.25,67.12 | v33.25,58.25 31.12,56.12 30.38,56.12 30,55.75 IC10.10 | v37.62,69.88 36.25,69.88 IC12.10 | v37.62,83.12 36.38,83.12 36.25,83.25 IC11.10 | v40,73.12 v43.25,73.12 | v48.5,98.75 47.75,98.75 IC15.3
  Bottom 0.508: 31.25,98.5 27.25,94.5 C1.2 27,94.25 27,89.12 25.12,87.25 v25.12,83.75 27.62,83.75 29,82.38 36.88,82.38 | 31.25,98.5 32.12,99.38 47.62,99.38 48.25,98.75 v48.5,98.75 | IC7.16 17.88,97.75 19.25,97.75 20.12,98.62 31.12,98.62 31.25,98.5 | C8.2 59,47.62 62.38,47.62 C10.2 62.62,47.62 62.88,47.62 66.88,51.62 69.25,51.62 70.62,53 70.62,70.62 68.25,73 ZIF40.11 | 39.38,73.75 39.75,74.12 39.75,79.25 | 39.38,73.75 36.56,70.94 | 36.56,70.94 33.62,68 33.62,66.88 C9.2 | 39.75,79.25 39.75,80.5 C3.2 | v33.25,58.25 33.25,66.38 33.5,66.62 C9.2 | 36.56,70.94 v37.62,69.88 | 36.88,82.38 v37.62,83.12 | 36.88,82.38 36.88,81.88 39.5,79.25 39.75,79.25 | v32.25,67.12 33,66.38 C9.2 | v43.25,73.12 52.88,73.12 ZIF40.30 | 39.38,73.75 v40,73.12
GND.2  (via drill 0.3, 0.5)
  Top 0.508: v88.2,9.53 88.58,9.15 90.58,9.15 U1.21 | 81.08,8.28 80.83,8.28 80.83,6.65 | 81.08,8.28 82.08,8.28 U1.5 | 80.83,6.65 80.33,6.15 Y1.2 | 81.08,9.9 U1.3 v83.2,9.9 | 81.08,8.28 81.08,9.9 | 80.83,6.65 80.83,2.65 79.7,1.52 GND.TP | v81.08,35.52 81.08,36.52 81.58,37.02 R34.1 | 81.08,9.9 79.45,11.53 79.45,22.65 78.45,23.65 DIS6.7 | IC9.2 86.2,87.03 83.7,87.03 R36.1 83.45,86.9 83.45,86.78 78.45,81.78 DIS1.7 | C14.1 86.2,87.28 IC9.2 | IC9.2 86.45,86.78 86.45,85.15 88.95,85.15 C13.1 89.25,85 90.5,83.75 98,83.75 98.25,83.5 GND..TP | 79.33,48.27 79.45,48.4 79.45,57.02 78.45,58.02 DIS3.7 78.83,57.9 81.45,60.52 R33.1 | 79.33,48.27 78.45,47.4 DIS4.7 | DIS5.7 78.45,34.52 79.45,35.52 79.45,48.15 79.33,48.27 | v86.25,45.5 84.75,45.5 84.75,48 84.73,48.36
  Bottom 0.508: v88.2,9.53 86.95,9.53 86.45,10.03 JTAG1.2 86.2,9.9 v83.2,9.9 | 82.08,30.77 82.33,30.77 | 79.2,33.65 78.45,34.4 DIS5.7 | 79.2,33.65 82.08,30.77 | 79.2,33.65 v81.08,35.52 | 82.08,30.77 82.08,28.4 78.45,24.77 78.45,23.77 DIS6.7 | U$1.GND 78.08,85.15 78.08,82.03 78.33,81.78 DIS1.7 | v86.25,45.5 94.75,45.5 94.75,75.75 89.75,80.75 89.75,82.75 87.25,85.25 82.25,85.25 82.25,80.25 82.49,80.15
  Bottom 0.813: C11.1 83.4,67.1 v83.4,68.6
  other vias: 98.2,94.4 74.4,78.2 83.2,78.2 97.6,77 88.8,78 92,78 91.4,90.4 96.6,89.8 74.4,10.8 97.6,8 98.2,32
  pour Bottom (isolate 0.254): 72.8,99.6 99.6,99.6 99.6,0.4 72.6,0.4 72.6,99.6
  pour Top (isolate 0.254): 72.8,99.6 99.6,99.6 99.6,0.4 72.6,0.4 72.6,99.6
LOWER.  (via drill 0.3)
  Top 0.254: 41.19,97.56 41.38,97.75 43.62,97.75 44,97.38 44,96.88 READ2..3 | 41.19,97.56 40.5,96.88 READ1..3 | v37.88,94.12 22.5,94.12 21.88,93.5 13.38,93.5 v7.25,87.38 | v41.25,97.5 41.19,97.56
  Bottom 0.254: v37.88,94.12 v41.25,97.5 | v7.25,87.38 7.25,84.5 2.62,79.88 IC7.24
N$7  (via drill 0.3)
  Top 0.254: v31.75,55.75 40,55.75 IC10.11 | v23.75,60.75 23.62,60.88 22.88,60.88 19.12,64.62 17.88,64.62 IC7.3
  Bottom 0.254: v31.75,55.75 28.75,55.75 v23.75,60.75
N$8  (via drill 0.3)
  Top 0.254: v39.38,97.88 39.5,97.88 39.5,96.88 READ1..2 | v37,95.5 36.25,94.75 IC11.1
  Bottom 0.254: v37,95.5 v39.38,97.88
N$9  (via drill 0.3)
  Top 0.254: v43.12,95 43.12,96.75 READ2..2 | v42.75,86.5 41.38,86.5 38.25,83.38 38.25,81.7 37.92,81.38 36.25,81.38 IC12.1
  Bottom 0.254: v43.12,95 43.12,94.62 41,92.5 41,88.25 v42.75,86.5
N$10  (via drill 0.3)
  Top 0.254: v26.75,97.88 26.75,96.88 WRITE1..2 | v26,89.12 26.38,88.75 27.75,88.75 32.25,84.25 32.25,83.58 32.45,83.38 33.62,83.38 IC13.11
  Bottom 0.254: v26.75,97.88 26.75,96.38 26,95.62 v26,89.12
N$11  (via drill 0.3)
  Top 0.254: v25.38,94.75 29.23,94.75 30.38,95.89 30.38,96.75 WRITE2..2 | v30.88,72.12 33,70 33.62,70 IC14.11
  Bottom 0.254: v25.38,94.75 25.38,88.25 24.5,87.38 24.5,83.5 25.38,82.62 26.88,82.62 30.88,78.62 v30.88,72.12
N$12  (via drill 0.3)
  Top 0.254: 68.12,96 ZIF40.20 | v46.75,98.62 46,98.62 IC15.4
  Bottom 0.254: v46.75,98.62 47.62,98.62 48.88,97.38 66.75,97.38 68.12,96 ZIF40.20
N$29
  Bottom 0.254: R31.2 65.5,55.25 68.12,55.25 ZIF40.4
N$30
  Bottom 0.254: ZIF40.3 R32.2
N$31
  Bottom 0.254: R30.2 65.5,57.75 68.12,57.75 ZIF40.5
N$32
  Bottom 0.254: R29.2 65.5,60.38 68.12,60.38 ZIF40.6
N$33
  Bottom 0.254: R28.2 65.5,62.88 68.12,62.88 ZIF40.7
N$34
  Bottom 0.254: R27.2 65.5,65.5 68.12,65.5 ZIF40.8
N$35
  Bottom 0.254: R26.2 68.12,68 ZIF40.9
N$36
  Bottom 0.254: R25.2 65.5,70.5 68.12,70.5 ZIF40.10
N$37
  Bottom 0.254: R24.2 65.5,75.62 68.12,75.62 ZIF40.12
N$38
  Bottom 0.254: R23.2 65.5,78.12 68.12,78.12 ZIF40.13
N$39
  Bottom 0.254: R22.2 65.5,80.75 68.12,80.75 ZIF40.14
N$40
  Bottom 0.254: R21.2 68.12,83.25 ZIF40.15
N$41
  Bottom 0.254: R20.2 68.12,85.75 ZIF40.16
N$42
  Bottom 0.254: R19.2 65.5,88.25 68.12,88.25 ZIF40.17
N$43
  Bottom 0.254: R18.2 65.5,90.88 68.12,90.88 ZIF40.18
N$44
  Bottom 0.254: R17.2 65.5,93.38 68.12,93.38 ZIF40.19
N$45
  Top 0.254: DIS1.3 88.45,81.65 87.58,80.78 87.58,71.9 88.45,71.03 DIS2.3 88.45,70.9 86.7,69.15 86.7,61.27 86.83,61.15 86.83,59.77 88.45,58.15 DIS3.3 88.45,58.02 87.58,57.15 87.58,48.27 DIS4.3 88.45,47.27 86.83,45.65 86.83,36.15 88.45,34.52 DIS5.3 88.58,34.4 89.58,33.4 89.58,22.65 | 89.58,22.65 89.58,15.15 89.33,14.9 89.33,13.15 89.2,13.03 U1.25 | 89.58,22.65 88.58,23.65 DIS6.3
N$46  (via drill 0.3)
  Top 0.254: DIS1.2 91.08,81.65 90.08,80.65 90.08,73.03 90.33,72.78 90.33,71.78 91.08,71.03 DIS2.2 90.33,70.15 90.33,64.53 90.08,64.28 90.08,61.52 90.45,61.15 90.45,58.77 91.08,58.15 DIS3.2 91.2,58.02 92.08,57.15 92.08,48.27 91.2,47.4 DIS4.2 91.2,47.27 92.08,46.4 92.08,33.65 92.01,33.59 | v88.58,14.15 88.58,13.15 88.45,13.03 U1.26 | 92.01,33.59 92.08,33.52 92.08,24.65 91.2,23.77 DIS6.2 | 92.01,33.59 91.2,34.4 DIS5.2
  Bottom 0.254: v88.58,14.15 90.08,15.65 90.08,22.65 91.08,23.65 DIS6.2
N$47
  Top 0.254: U1.27 87.7,12.9 87.83,12.78 87.83,12.28 88.08,12.03 89.83,12.03 89.83,14.78 91.08,16.02 DIS6.13 | DIS4.13 91.08,39.77 90.08,40.77 90.08,49.4 91.08,50.4 DIS3.13 | DIS2.13 91.2,63.4 92.08,64.28 92.08,73.15 91.2,74.03 DIS1.13
  Bottom 0.254: DIS6.13 91.2,16.15 92.08,17.02 92.08,24.77 91.2,25.65 91.2,26.77 DIS5.13 91.2,26.9 91.2,30.02 94.58,33.4 94.58,36.27 91.2,39.65 DIS4.13 | DIS3.13 91.2,50.52 91.2,56.27 92.08,57.15 92.08,62.4 91.2,63.27 DIS2.13
N$48
  Top 0.254: 87.64,15.21 88.45,16.02 DIS6.12 | 87.64,15.21 86.95,14.53 86.95,13.15 86.83,13.03 U1.28 | DIS5.12 88.45,26.77 87.58,25.9 87.58,15.28 87.64,15.21 | DIS4.12 88.58,39.77 89.58,40.77 89.58,49.4 88.58,50.4 DIS3.12 | DIS2.12 88.58,63.4 89.83,64.65 89.83,72.65 88.58,73.9 88.58,74.03 DIS1.12
  Bottom 0.254: DIS3.12 88.45,50.52 88.45,56.15 87.58,57.02 87.58,62.4 88.45,63.27 DIS2.12 | DIS5.12 88.45,26.9 88.45,30.4 87.58,31.27 87.58,38.77 88.45,39.65 DIS4.12
N$49  (via drill 0.3)
  Top 0.254: DIS1.8 78.33,74.03 77.45,73.15 77.45,64.28 78.33,63.4 DIS2.8 78.33,63.27 77.45,62.4 77.45,49.52 | 77.45,49.52 77.45,40.65 78.33,39.77 DIS4.8 78.33,39.65 77.45,38.77 77.45,26.02 77.51,25.96 | 77.45,49.52 78.33,50.4 DIS3.8 | v84.95,11.4 84.95,4.78 85.2,4.53 U1.11 | 77.51,25.96 77.45,25.9 77.45,17.02 78.33,16.15 DIS6.8 | 77.51,25.96 78.33,26.77 DIS5.8
  Bottom 0.254: v84.95,11.4 80.33,16.02 78.45,16.02 DIS6.8
N$50
  Top 0.254: LED2.A 87.58,60.77 89.58,60.77 LED1.C
N$51
  Top 0.254: LED4.A 87.58,37.27 89.58,37.27 LED3.C
N$52
  Top 0.254: LED4.C 85.95,37.27 84.45,37.27 84.45,37.15 R34.2
N$53
  Top 0.254: LED2.C 85.95,60.77 84.45,60.77 R33.2
N$54
  Top 0.254: LED3.A 91.08,37.27 90.08,36.27 90.08,19.15 92.08,17.15 92.08,12.9 90.7,11.53 U1.24
N$55
  Top 0.254: LED1.A 92.58,59.27 92.58,12.4 91.7,11.53 91.7,11.15 91.33,10.78 90.7,10.78 U1.23
N$56  (via drill 0.3)
  Top 0.254: v84.58,14.28 84.58,13.15 84.45,13.03 U1.31
  Bottom 0.254: v84.58,14.28 84.58,28.9 84.7,29.02 84.7,80.53 83.58,81.65 DIS1.5
N$57  (via drill 0.3)
  Top 0.254: v84.08,29.27 84.45,28.9 84.45,15.03 83.83,14.4 83.83,13.15 83.7,13.03 U1.32
  Bottom 0.254: 83.99,31.99 82.45,33.52 82.45,69.9 DIS2.5 | 83.99,31.99 84.08,31.9 | v84.08,29.27 84.25,29.5 84.25,31.75 84,32 83.99,31.99
N$58  (via drill 0.3)
  Top 0.254: v82.33,23.9 82.33,11.65 82.2,11.53 U1.1 | v80.45,25.77 80.45,55.02 83.45,58.02 DIS3.5
  Bottom 0.254: v80.45,25.77 v82.33,23.9
N$59
  Top 0.254: U1.2 82.08,10.78 81.08,10.78 81.08,34.4 82.7,36.02 82.7,38.4 82.45,38.65 82.45,46.27 83.45,47.27 DIS4.5
N$60  (via drill 0.3)
  Top 0.254: v83.83,10.78 83.83,4.65 83.7,4.53 U1.9 | v81.7,12.9 81.7,32.65 83.45,34.4 DIS5.5
  Bottom 0.254: v81.7,12.9 v83.83,10.78
N$61  (via drill 0.3)
  Top 0.254: v83.58,11.9 84.45,11.03 84.45,4.53 U1.10
  Bottom 0.254: v83.58,11.9 81.08,14.4 78.08,14.4 77.45,15.03 77.45,17.65 83.45,23.65 DIS6.5
N$62  (via drill 0.3)
  Top 0.254: U1.17 91.83,5.9 v91.83,6.15
  Bottom 0.254: v91.83,6.15 91.83,9.03 90.83,10.03 90.08,10.03 JTAG1.1
N$63  (via drill 0.3)
  Top 0.254: 88.14,7.09 89.95,5.28 94.2,5.28 R35.1 | 88.14,7.09 86.2,9.03 86.2,12.78 86.08,12.9 U1.29 | v88.2,7.15 88.14,7.09
  Bottom 0.254: v88.2,7.15 87.95,7.4 86.45,7.4 JTAG1.6
N$64  (via drill 0.3)
  Top 0.254: v88.95,3.27 88.95,4.15 U1.16
  Bottom 0.254: v88.95,3.27 85.95,3.27 84.7,4.53 84.7,7.9 84.95,8.15 87.7,8.15 87.95,7.9 88.45,7.9 89.2,8.65 89.95,8.65 JTAG1.3
N$65  (via drill 0.3)
  Top 0.254: v88.33,5.53 88.33,4.53 U1.15
  Bottom 0.254: v88.33,5.53 89.45,5.53 89.95,5.03 JTAG1.9
N$66  (via drill 0.3)
  Top 0.254: v83.2,6.65 82.2,6.65 U1.7 | v77.08,2.77 77.7,3.4 77.7,6.9 78.08,7.28 78.18,7.3
  Bottom 0.254: v83.2,6.65 82.95,6.65 78.45,2.15 77.7,2.15 v77.08,2.77
N$67
  Top 0.254: U1.8 82.08,5.9 81.45,5.28 81.45,1.4 80.45,0.4 78.58,0.4 78.58,4.03 78.33,4.28 78.33,4.78 Y1.3
N$68  (via drill 0.3)
  Top 0.254: v93.45,98.15 93.45,98.28 91.83,98.28 R39.1
  Bottom 0.254: U$1.REST v93.45,98.15
N$69  (via drill 0.3)
  Top 0.254: v93.45,94.15 93.45,95.03 91.83,95.03 R40.1
  Bottom 0.254: U$1.CH_PD v93.45,94.15
N$70  (via drill 0.3)
  Top 0.254: v90.25,92.75 95.5,92.75 98.25,90 RX.TP | v87.75,95.25 86.5,96.5 v79.75,96.5
  Bottom 0.254: v87.75,95.25 v90.25,92.75 | v79.75,96.5 79.25,97 78,97 U$1.RX
N$71  (via drill 0.3)
  Top 0.254: U1.30 85.2,22.52 84.95,22.77 84.95,31.65 84.08,32.52 v82.58,32.52 | v89.75,88 98.25,88 TX.TP
  Bottom 0.254: v82.58,32.52 82.58,32.77 81.7,33.65 81.7,88.25 | 81.7,88.25 81.7,95.53 78.08,99.15 U$1.TX | v89.75,88 89.5,88.25 81.7,88.25
N$72  (via drill 0.3)
  Top 0.254: v78.95,86.15 78.95,87.03 80.7,87.03 R36.2
  Bottom 0.254: U$1.GPIO15 v78.95,86.15
N$73  (via drill 0.3)
  Top 0.254: v79.45,90.03 80.7,90.03 R37.1
  Bottom 0.254: v79.45,90.03 78.95,90.03 78.08,89.15 U$1.GPIO2
N$74  (via drill 0.3)
  Top 0.254: v79.58,91.9 80.7,93.03 R38.1
  Bottom 0.254: v79.58,91.9 78.83,91.9 78.08,91.15 U$1.GPIO0
OE.  (via drill 0.3)
  Top 0.254: 22,94.75 20.9,94.75 20.25,95.4 20.25,96.47 22.78,99 43.12,99 44.12,98 IC15.2 | 22,94.75 23.5,94.75 IC13.1 23.62,94.75 23.88,94.75 25.06,95.94 | 25.06,95.94 25.88,96.75 WRITE1..1 | WRITE2..1 29.5,96.75 28.62,95.88 25.12,95.88 25.06,95.94 | v22,81.38 23.5,81.38 IC14.1 | v22,94.5 22,94.75
  Bottom 0.254: IC7.29 2.62,67.25 3.12,67.25 17.25,81.38 v22,81.38 v22,94.5
Q0.  (via drill 0.3)
  Top 0.254: IC13.19 33.75,93.5 36.12,93.5 IC11.2 36.25,93.5 42.5,93.5 45.12,96.12 45.38,96.12 45.88,96.62 v46.25,96.62
  Bottom 0.254: R17.1 63.5,93.5 57.38,93.5 54,96.88 46.5,96.88 v46.25,96.62
Q1.  (via drill 0.3)
  Top 0.254: v45.38,95.5 v46.88,95.5 | v41.62,92.25 36.25,92.25 IC11.3 36.12,92.25 33.75,92.25 IC13.18
  Bottom 0.254: v46.88,95.5 47.38,95 53.38,95 57.5,90.88 63.5,90.88 R18.1 | v45.38,95.5 44.88,95.5 v41.62,92.25
Q2.  (via drill 0.3)
  Top 0.254: v55.75,88.38 54.25,89.88 50.75,89.88 49.12,91.5 42.38,91.5 41.88,91 36.25,91 IC11.4 36.12,91 33.75,91 IC13.17
  Bottom 0.254: v55.75,88.38 63.5,88.38 R19.1
Q3.  (via drill 0.3)
  Top 0.254: v47.75,84.25 47.38,83.88 v43.38,83.88 | v37.62,89.62 36.25,89.62 IC11.5 36.12,89.62 33.75,89.62 IC13.16
  Bottom 0.254: R20.1 55,85.75 53.5,84.25 v47.75,84.25 | v37.62,89.62 v43.38,83.88
Q4.  (via drill 0.3)
  Top 0.254: v60,83.25 54,89.25 50.75,89.25 49.38,87.88 48.5,87.88 47.38,89 36.88,89 36.25,88.38 IC11.6 36.12,88.38 33.75,88.38 IC13.15
  Bottom 0.254: v60,83.25 R21.1
Q5.  (via drill 0.3)
  Top 0.254: v44.75,80.62 44.5,80.88 44.38,80.88 v41.62,83.62 | v37.62,87.12 36.25,87.12 IC11.7 36.12,87.12 33.75,87.12 IC13.14
  Bottom 0.254: v44.75,80.62 45.62,79.75 55,79.75 55.88,80.62 63.5,80.62 R22.1 | v41.62,83.62 41.62,84.62 39.12,87.12 v37.62,87.12
Q6.  (via drill 0.3)
  Top 0.254: v40.88,83.38 v44.25,80 | v37.62,85.75 36.25,85.75 IC11.8 36.12,85.88 33.75,85.88 IC13.13
  Bottom 0.254: v44.25,80 44.75,80 45.5,79.25 53.88,79.25 54.88,78.25 63.5,78.25 R23.1 | v40.88,83.38 40.88,84.75 39.88,85.75 v37.62,85.75
Q7.  (via drill 0.3)
  Top 0.254: v43.75,79.38 40.25,82.88 v38.88,82.88 | v37.62,84.12 37.25,84.5 36.25,84.5 IC11.9 36.12,84.62 33.75,84.62 IC13.12
  Bottom 0.254: v43.75,79.38 44.75,79.38 47,77.12 59,77.12 60.5,75.62 63.5,75.62 R24.1 | v37.62,84.12 v38.88,82.88
Q8.  (via drill 0.3)
  Top 0.254: v43.25,78.75 42,80 36.25,80 IC12.2 36.12,80.12 33.75,80.12 IC14.19
  Bottom 0.254: v43.25,78.75 44.75,78.75 46.88,76.62 58.88,76.62 63.5,72 63.5,70.62 R25.1
Q9.  (via drill 0.3)
  Top 0.254: v47.75,74 v55,74 | v44.88,76.88 32.5,76.88 32.25,77.12 32.25,78.75 33.62,78.75 IC14.18 33.75,78.88 36.12,78.88 IC12.3
  Bottom 0.254: R26.1 60.88,68 55,73.88 v55,74 | v44.88,76.88 v47.75,74
Q10.  (via drill 0.3)
  Top 0.254: v44.75,77.88 44.38,77.5 36.25,77.5 IC12.4 36.12,77.5 33.75,77.5 IC14.17
  Bottom 0.254: v44.75,77.88 48.5,74.12 54,74.12 62.62,65.5 63.5,65.5 R27.1
Q11.  (via drill 0.3)
  Top 0.254: v42.12,64.5 v62,64.5 | v40.62,74.88 39.38,76.12 36.25,76.12 IC12.5 36.12,76.25 33.75,76.25 IC14.16
  Bottom 0.254: v62,64.5 63.5,63 R28.1 | v42.12,64.5 42.12,69.25 39.75,71.62 39.75,72.12 40.12,72.5 40.25,72.5 40.62,72.88 v40.62,74.88
Q12.  (via drill 0.3)
  Top 0.254: v43.5,72.12 43.12,72.5 38.75,72.5 37.5,73.75 37.5,74.88 36.25,74.88 IC12.6 36.12,75 33.75,75 IC14.15
  Bottom 0.254: v43.5,72.12 54.5,72.12 57.25,69.38 57.25,67.38 63.5,61.12 63.5,60.5 R29.1
Q13.  (via drill 0.3)
  Top 0.254: v54.5,71.25 54,71.75 44.5,71.75 44,71.25 37.88,71.25 37.38,71.75 32.5,71.75 32.25,72 32.25,73.62 33.62,73.62 IC14.14 33.75,73.75 36.12,73.75 IC12.7
  Bottom 0.254: v54.5,71.25 56.75,69 56.75,65.38 63.5,58.62 63.5,57.88 R30.1
Q14.  (via drill 0.3)
  Top 0.254: v44.62,69 44.12,69.5 v42.75,69.5 | v40.38,71.88 40.25,72 37.75,72 37.38,72.38 36.25,72.38 IC12.8 36.12,72.5 33.75,72.5 IC14.13
  Bottom 0.254: v44.62,69 54.62,69 56.25,67.38 56.25,63.25 63.5,56 63.5,55.38 R31.1 | v40.38,71.88 v42.75,69.5
Q15.  (via drill 0.3)
  Top 0.254: v54.38,62 54.25,61.88 43,61.88 v42.12,62.75 | v38.75,69.62 37.25,71.12 36.25,71.12 IC12.9 36.12,71.25 33.75,71.25 IC14.12
  Bottom 0.254: v54.38,62 54.38,61.88 63.5,52.75 R32.1 | v42.12,62.75 42.12,63.62 38.75,67 v38.75,69.62
UPPER.  (via drill 0.3)
  Top 0.254: READ2..1 42.38,96.75 41.5,95.88 38.88,95.88 38.88,96.75 READ1..1 38.75,96.88 37.12,98.5 23.5,98.5 v20.88,95.88
  Bottom 0.254: v20.88,95.88 19.25,95.88 18.5,96.62 5.62,96.62 3.62,98.62 1.5,98.62 0.5,97.62 0.5,71.75 2.5,69.75 IC7.28
VPP.  (via drill 0.3)
  Top 0.508: v28.5,59.5 17.88,59.5 IC7.1
  Bottom 0.508: ZIF40.1 68.12,47.62 65.25,47.62 C10.1 65,47.5 63.75,46.25 52.25,46.25 51.25,47.25 51.25,48.25 47.12,52.38 37.12,52.38 30,59.5 v28.5,59.5

### Text on the board
tNames: JEDEC / 27C1024 / 27C2048 / 27C4096 / 27C102 / 27C202 / 27C210 / 27C220 / 27C240 / 27C4000 / 27C4002 / 27C400 / 27C402 / 27C404 / 29C1024
bNames: JEDEC | 1k | 2018 Jelmer Bruijn | 1k | 2018 Jelmer Bruijn